# EasyEDA Pro project FireWheels.eprj, schematic Schematic1

## Sheets
1 P1: Board Name: RobotMotherboard; Create Date: 2025-05-01; Page Name: P1; Project Name: FireWheels; Schematic Name: Schematic1; Update Date: 2025-05-03; Company: EasyEDA.com; Page Size: A4; Version: V1.0
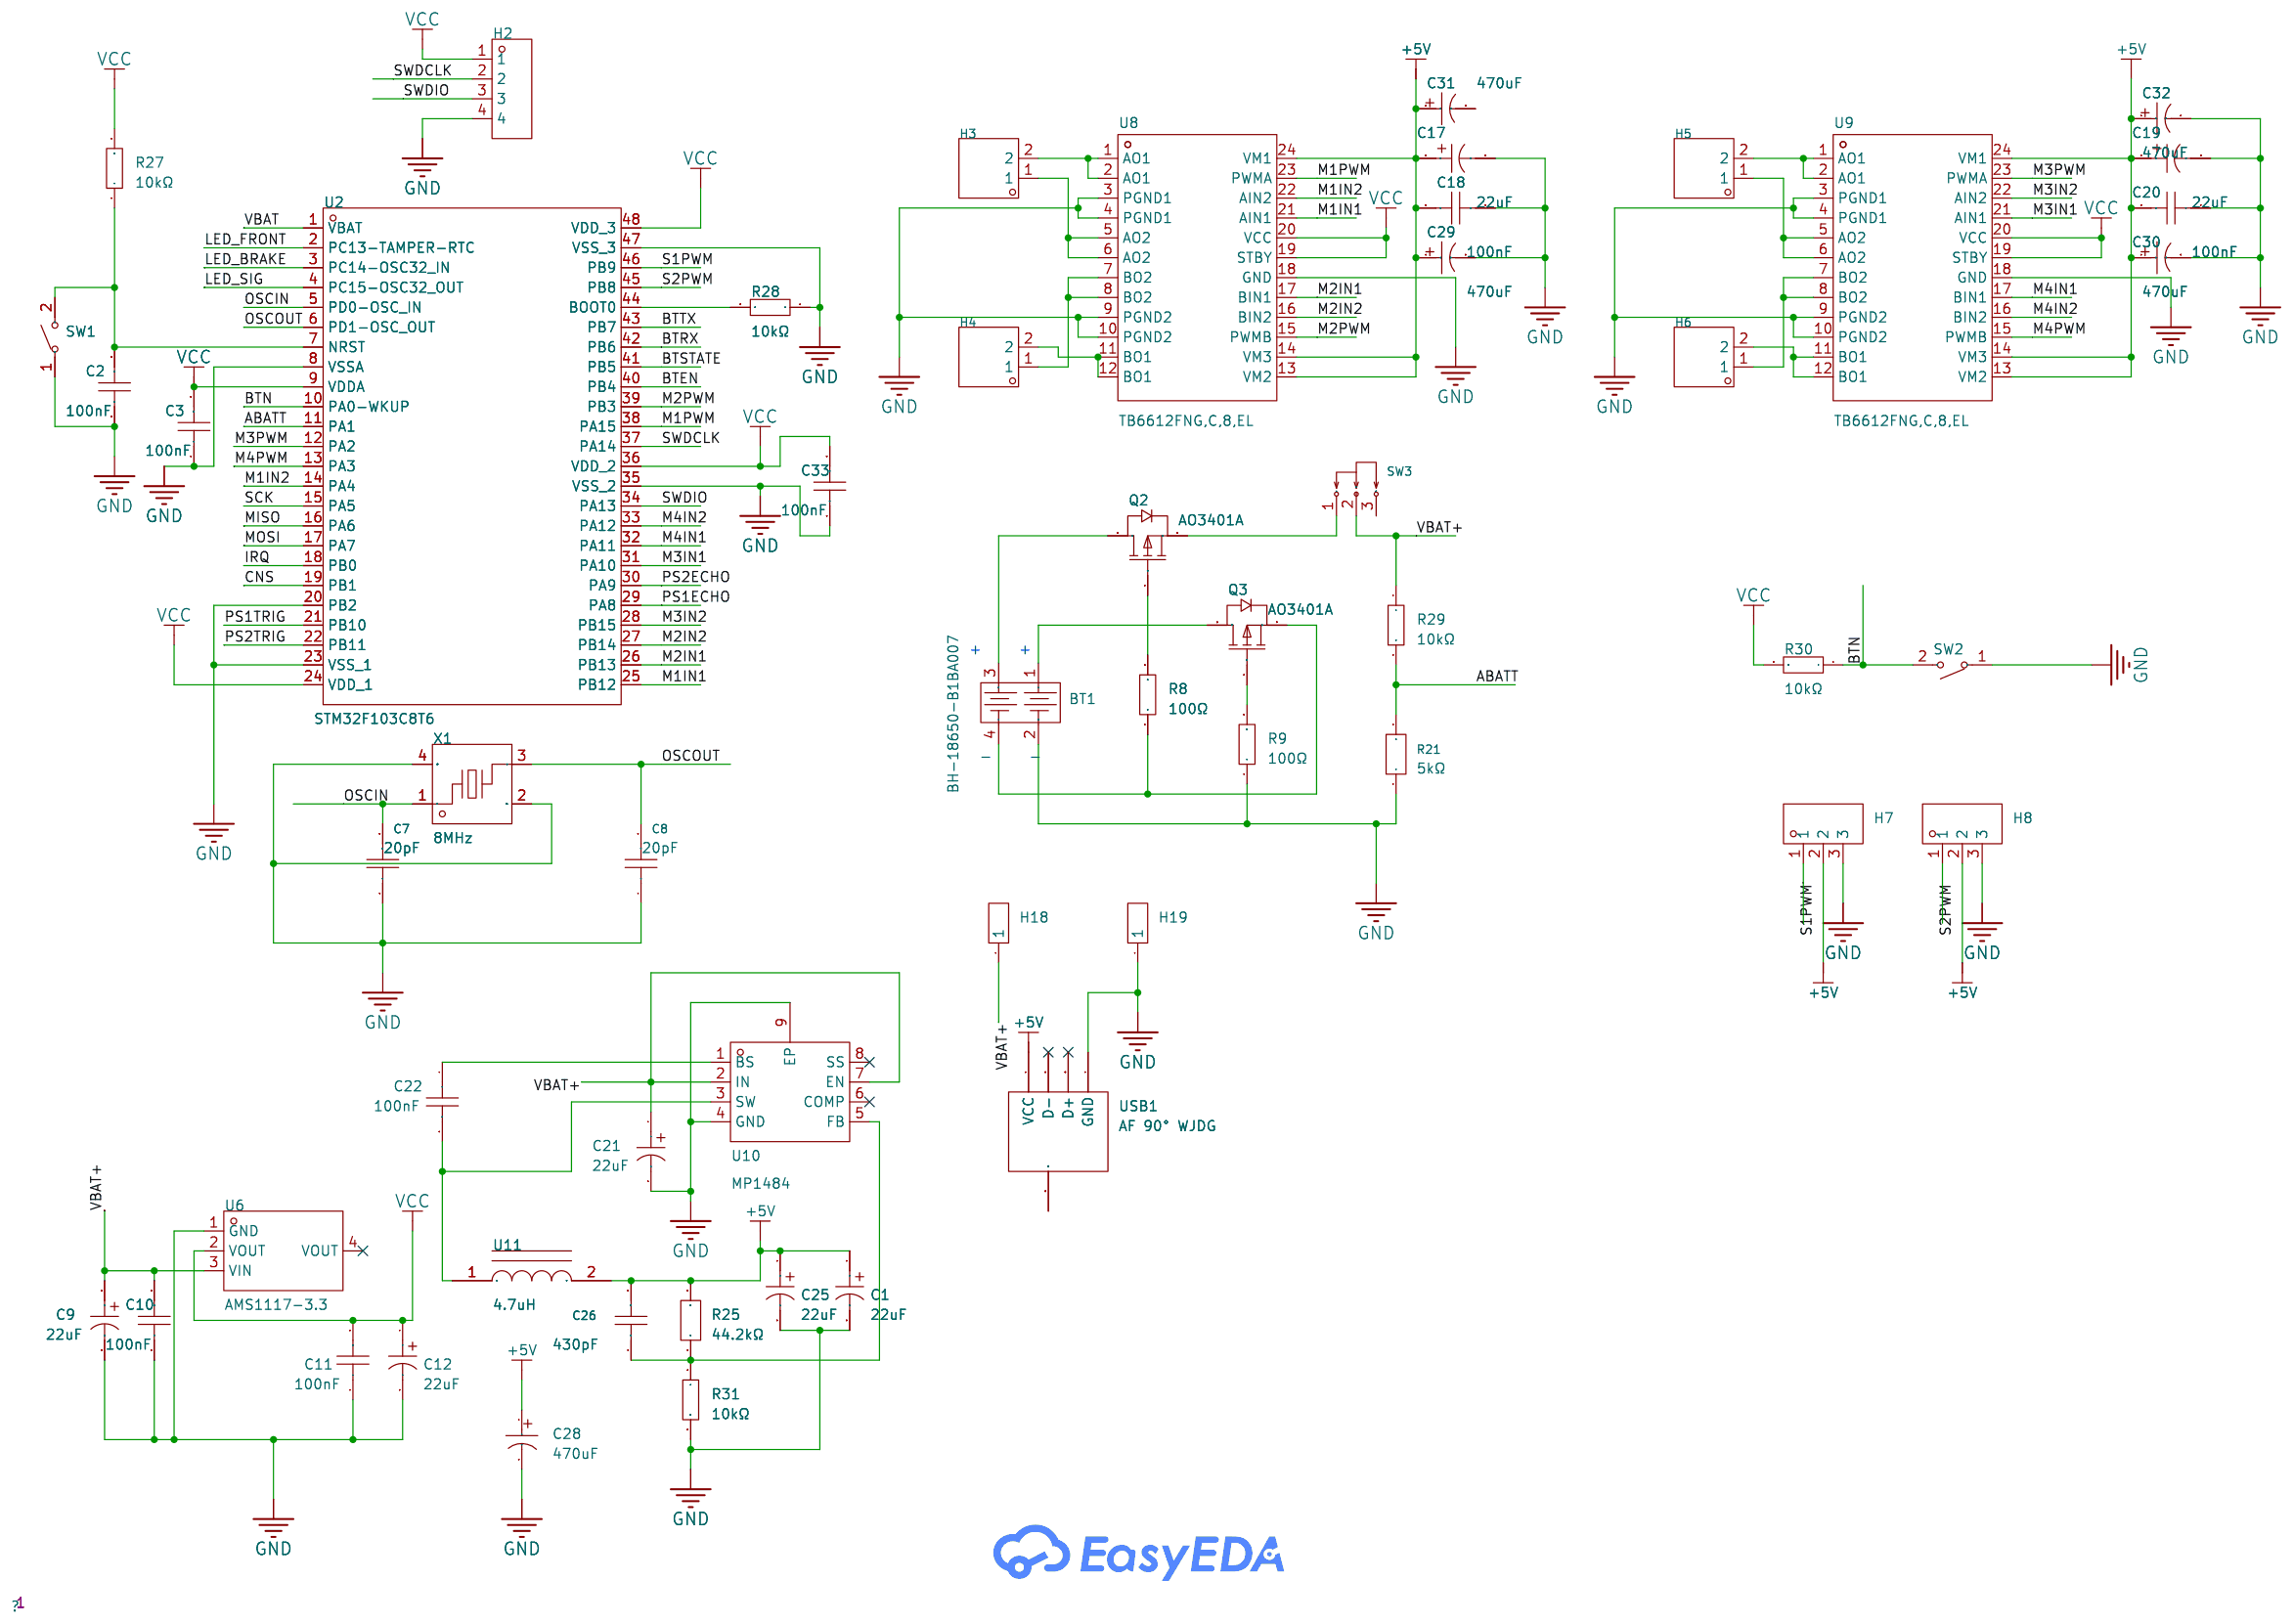
[diagram p0: P1]
2 P2: Create Date: 2025-05-02; Page Name: P2
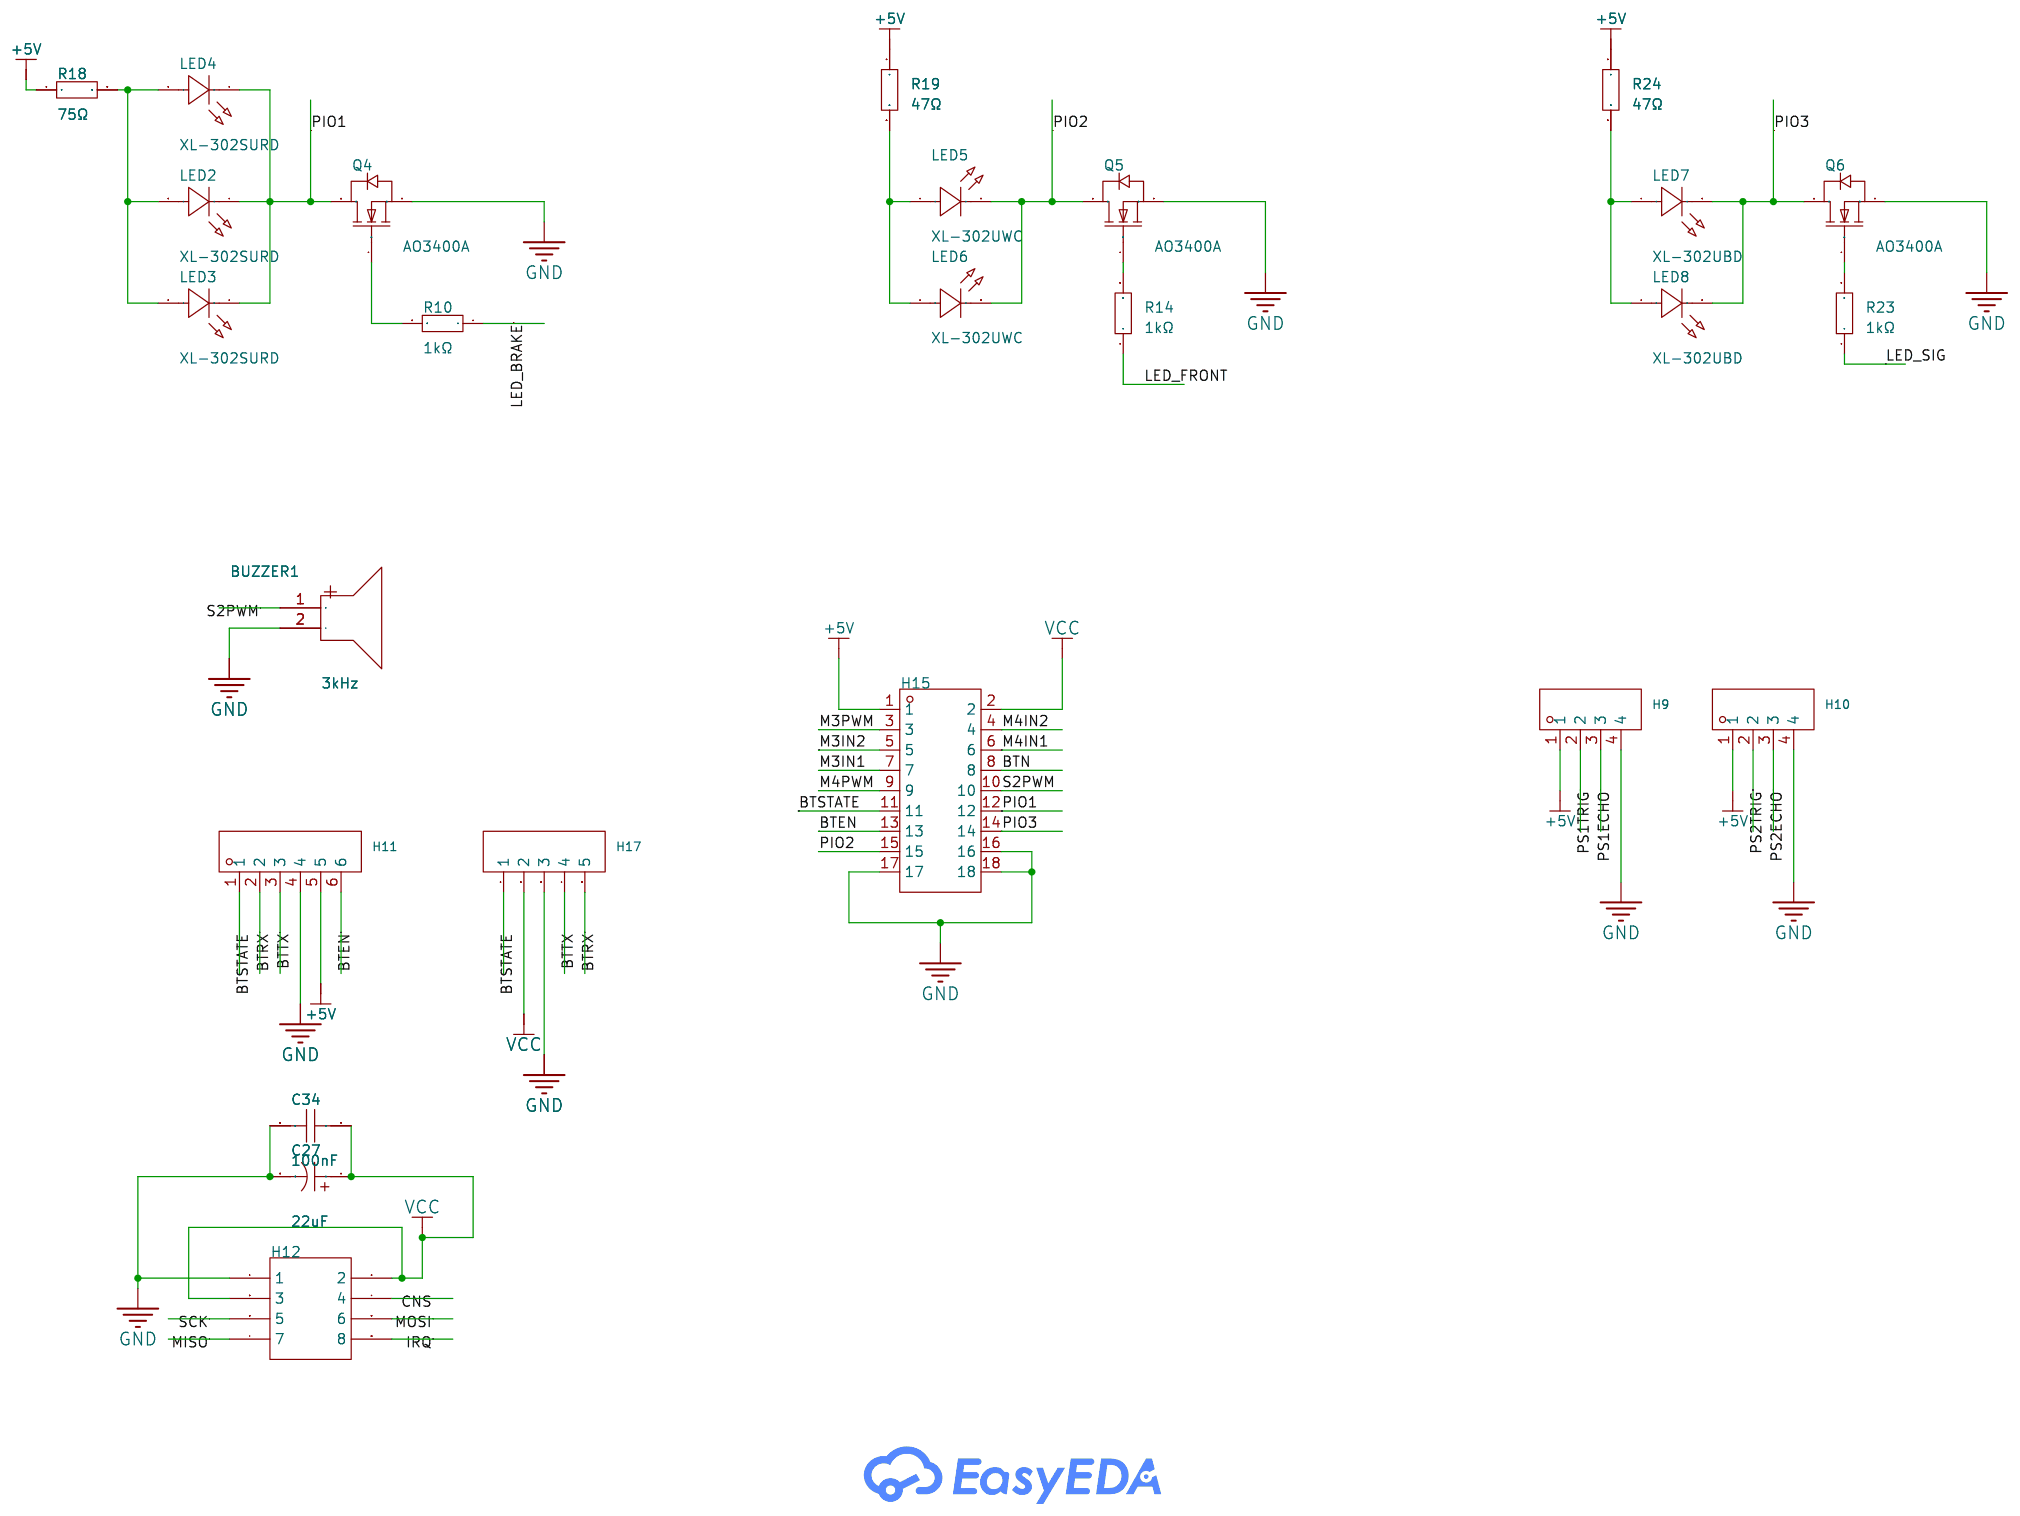
[diagram p1: P2]

## Parts
sheet P1
BT1  BH-18650-B1BA007  [BAT-SMD_BH-18650-B1BA007]
C1  22uF  [CAP-SMD_L3.5-W2.8-FD]
C2  100nF  [C0805]
C3  100nF  [C0805]
C7  20pF  [C0603]
C8  20pF  [C0603]
C9  22uF  [CAP-SMD_L3.5-W2.8-FD]
C10  100nF  [C0805]
C11  100nF  [C0805]
C12  22uF  [CAP-SMD_L3.5-W2.8-FD]
C17  22uF  [CAP-SMD_L3.5-W2.8-FD]
C18  100nF  [C0805]
C19  22uF  [CAP-SMD_L3.5-W2.8-FD]
C20  100nF  [C0805]
C21  22uF  [CAP-SMD_L3.5-W2.8-FD]
C22  100nF  [C0805]
C25  22uF  [CAP-SMD_L3.5-W2.8-FD]
C26  430pF  [C0603]
C28  470uF  [CAP-TH_BD8.0-P3.50-D0.6-FD]
C29  470uF  [CAP-TH_BD8.0-P3.50-D0.6-FD]
C30  470uF  [CAP-TH_BD8.0-P3.50-D0.6-FD]
C31  470uF  [CAP-TH_BD8.0-P3.50-D0.6-FD]
C32  470uF  [CAP-TH_BD8.0-P3.50-D0.6-FD]
C33  100nF  [C0805]
H2  -  [HDR-TH_4P-P2.54-V-M]
H3  -  [HDR-TH_2P-P2.54-V-M-1]
H4  -  [HDR-TH_2P-P2.54-V-M-1]
H5  -  [HDR-TH_2P-P2.54-V-M-1]
H6  -  [HDR-TH_2P-P2.54-V-M-1]
H7  -  [HDR-TH_3P-P2.54-V-M]
H8  -  [HDR-TH_3P-P2.54-V-M]
H18  -  [HDR-TH_1P-V-M_XKB_X4611WV-01I-C28D40]
H19  -  [HDR-TH_1P-V-M_XKB_X4611WV-01I-C28D40]
Q2  AO3401A  [SOT-23_L2.9-W1.3-P1.90-LS2.4-BR]
Q3  AO3401A  [SOT-23_L2.9-W1.3-P1.90-LS2.4-BR]
R8  100Ω  [R0603]
R9  100Ω  [R0603]
R21  5kΩ  [R0603]
R25  44.2kΩ  [R0603]
R27  10kΩ  [R0603]
R28  10kΩ  [R0603]
R29  10kΩ  [R0603]
R30  10kΩ  [R0603]
R31  10kΩ  [R0603]
SW1  -  [SW-SMD_L3.9-W3.0-P4.45]
SW2  -  [SW-SMD_L3.9-W3.0-P4.45]
SW3  SS12D10G4 071  [SW-TH_SHOU-HAN_SS12D10G4]
U2  STM32F103C8T6  [LQFP-48_L7.0-W7.0-P0.50-LS9.0-BL]
U6  AMS1117-3.3  [SOT-223-3_L6.7-W3.7-P2.30-LS7.0-BR]
U8  TB6612FNG,C,8,EL  [SSOP-24_L8.3-W5.6-P0.65-LS7.6-BL]
U9  TB6612FNG,C,8,EL  [SSOP-24_L8.3-W5.6-P0.65-LS7.6-BL]
U10  MP1484  [SOP-8_L4.9-W3.9-P1.27-LS6.0-BL-EP3.1]
U11  4.7uH  [IND-SMD_L4.4-W4.2]
USB1  AF 90° WJDG  [USB-A-TH_AF-WJDG]
X1  8MHz  [CRYSTAL-SMD_4P-L3.2-W2.5-BL]
sheet P2
BUZZER1  3kHz  [BUZ-TH_BD9.0-P5.00-D0.6-FD]
C27  22uF  [CAP-SMD_L3.5-W2.8-FD]
C34  100nF  [C0805]
H9  -  [HDR-TH_4P-P2.54-V-F]
H10  -  [HDR-TH_4P-P2.54-V-F]
H11  -  [HDR-TH_6P-P2.54-V-F]
H12  -  [HDR-TH_8P-P2.54-V-F-R2-C4-S2.54-1]
H15  -  [HDR-TH_18P-P2.54-V-M-R2-C9-S2.54]
H17  -  [HDR-TH_5P-P2.54-V-F]
LED2  XL-302SURD  [LED-TH_BD3.8-P2.54-RD]
LED3  XL-302SURD  [LED-TH_BD3.8-P2.54-RD]
LED4  XL-302SURD  [LED-TH_BD3.8-P2.54-RD]
LED5  XL-302UWC  [LED-TH_BD3.8-P2.54-FD_WHITE]
LED6  XL-302UWC  [LED-TH_BD3.8-P2.54-FD_WHITE]
LED7  XL-302UBD  [LED-TH_BD3.8-P2.54-FD_BLUE]
LED8  XL-302UBD  [LED-TH_BD3.8-P2.54-FD_BLUE]
Q4  AO3400A  [SOT-23-3_L2.9-W1.3-P1.90-LS2.4-BR]
Q5  AO3400A  [SOT-23-3_L2.9-W1.3-P1.90-LS2.4-BR]
Q6  AO3400A  [SOT-23-3_L2.9-W1.3-P1.90-LS2.4-BR]
R10  1kΩ  [R0603]
R14  1kΩ  [R0603]
R18  75Ω  [R1206]
R19  47Ω  [R1206]
R23  1kΩ  [R0603]
R24  47Ω  [R1206]

## Library data of the parts
BT1 = BH-18650-B1BA007: Connector Type:Battery box Battery Type:- Contact Material:Phosphor Bronze Contact Plating:Gold Operating Temperature Range:-25℃~+85℃ Operating Temperature Range:-25℃~+85℃; LCSC Part Name: 电池盒; Supplier Part: C6937126; Manufacturer: MYOUNG(美阳); Supplier Footprint: SMD; JLCPCB Part Class: Extended Part; Datasheet: https://atta.szlcsc.com/upload/public/pdf/source/20230625/4623181BB33816751543B6366072761C.pdf; Supplier: LCSC; Connector Type: Battery box; Contact Material: Phosphor Bronze; Contact Plating: Gold; Operating Temperature Range: -25℃~+85℃
C1 C9 C12 C17 C19 C21 C25 C27 = T491B226K004AT: Capacitance: Tolerance:±10% Tolerance:±10% Voltage Rating: Current - Leakage:- Ripple Current:- Equivalent Series Resistance(ESR):3.5Ω Operating Temperature:-55℃~+125℃ Operating Temperature:-55℃~+125℃; LCSC Part Name: 22uF ±10% 4V; Supplier Part: C1953267; Manufacturer: KEMET(基美); Supplier Footprint: 1411; JLCPCB Part Class: Extended Part; Datasheet: https://atta.szlcsc.com/upload/public/pdf/source/20210416/95C0EC5B3581C9A90529545117ABEAC1.pdf; Supplier: LCSC; Tolerance: ±10%; Equivalent Series Resistance(ESR): 3.5Ω; Operating Temperature: -55℃~+125℃
C2 C3 C10 C11 C18 C20 C22 C33 C34 = 0805B104K250NT: Capacitance:100nF Tolerance:±10% Tolerance:±10% Voltage Rating: Temperature Coefficient:; LCSC Part Name: 100nF ±10% 25V; Supplier Part: C5120075; Manufacturer: FH(风华); Supplier Footprint: 0805; JLCPCB Part Class: Extended Part; Datasheet: https://atta.szlcsc.com/upload/public/pdf/source/20220722/AC92D000C7DDA6224FF67F7486E69D7A.pdf; Supplier: LCSC; Tolerance: ±10%
C7 C8 = TCC0603COG200J500CT: Capacitance: Tolerance:±5% Tolerance:±5% Voltage Rated: Temperature Coefficient:; LCSC Part Name: 20pF ±5% 50V; Supplier Part: C376774; Manufacturer: CCTC(三环); Supplier Footprint: 0603; JLCPCB Part Class: Extended Part; Datasheet: https://atta.szlcsc.com/upload/public/pdf/source/20191203/C466239_F62A586702D44EEA1C39B32FC8662B21.pdf; Supplier: LCSC; Tolerance: ±5%
C26 = CC0603JRNPO9BN431: Capacitance: Tolerance:±5% Tolerance:±5% Voltage Rated: Temperature Coefficient:; LCSC Part Name: 430pF ±5% 50V; Supplier Part: C309472; Manufacturer: YAGEO(国巨); Supplier Footprint: 0603; JLCPCB Part Class: Extended Part; Datasheet: https://atta.szlcsc.com/upload/public/pdf/source/20191125/C354976_4A9AE911FA5758D8C0A36AE6394FD4D7.pdf; Supplier: LCSC; Tolerance: ±5%
C28-C32 = KM477M025F12RR0VH2FP0: Capacitance:470uF Tolerance:±20% Tolerance:±20% Voltage Rating:25V Pin Spacing:3.5mm Diameter:8mm Height - Seated (Max):12mm Lifetime:2000hrs@105℃; LCSC Part Name: 470uF ±20% 25V; Supplier Part: C43839; Manufacturer: CX(承兴); Supplier Footprint: 插件,D8xL12mm; JLCPCB Part Class: Extended Part; Datasheet: https://atta.szlcsc.com/upload/public/pdf/source/20230915/80F12A3CAB98DAEEC2984174CA9E6511.pdf; Supplier: LCSC; Tolerance: ±20%; Voltage Rating: 25V; Pin Spacing: 3.5mm; Diameter: 8mm; Height - Seated (Max): 12mm; Lifetime: 2000hrs@105℃
H2 = HDR-M_2.54_1x4P: Supplier Footprint: Through
H3-H6 = HDR-M_2.54_1x2P: Supplier Footprint: Through
H7 H8 = HDR-M_2.54_1x3P: Supplier Footprint: Through
H18 H19 = HDR-M_2.54_1x1P: Supplier Footprint: Through
Q2 Q3 = AO3401A_C15127: Type:1 Piece P-Channel Drain Source Voltage (Vdss): Continuous Drain Current (Id): Drain Source On Resistance (RDS(on)@Vgs,Id):44mΩ@10V,4.3A Power Dissipation (Pd): Gate Threshold Voltage (Vgs(th)@Id):1.3V@250uA Total Gate Charge (Qg@Vgs):12.2nC@4.5V Inpu; LCSC Part Name: 1个P沟道 耐压:30V 电流:4A; Supplier Part: C15127; Manufacturer: AOS; Supplier Footprint: SOT-23; JLCPCB Part Class: Basic Part; Datasheet: https://atta.szlcsc.com/upload/public/pdf/source/20160507/1462613609053.pdf; Supplier: LCSC; Type: 1 Piece P-Channel; Drain Source On Resistance (RDS(on)@Vgs,Id): 44mΩ@10V,4.3A; Gate Threshold Voltage (Vgs(th)@Id): 1.3V@250uA; Total Gate Charge (Qg@Vgs): 12.2nC@4.5V; Input Capacitance (Ciss@Vds): 1.2nF@15V; Operating Temperature: -55℃~+150℃@(Tj)
R8 R9 = 0603WAF1000T5E: Type:Thick Film Resistors Resistance: Tolerance:±1% Tolerance:±1% Power(Watts): Overload Voltage (Max): Temperature Coefficient:±200ppm/℃ Temperature Coefficient:±200ppm/℃ Operating Temperature Range:-55℃~+155℃ Operating Temperature Range:-55℃~+155℃; LCSC Part Name: 100Ω ±1% 100mW 厚膜电阻; Supplier Part: C22775; Manufacturer: UNI-ROYAL(厚声); Supplier Footprint: 0603; JLCPCB Part Class: Basic Part; Datasheet: https://atta.szlcsc.com/upload/public/pdf/source/20200306/C422600_1E6D84923E4A46A82E41ADD87F860B5C.pdf; Supplier: LCSC; Type: Thick Film Resistors; Tolerance: ±1%; Temperature Coefficient: ±200ppm/℃; Operating Temperature Range: -55℃~+155℃
R21 = RTT035001FTP: Type:Thick Film Resistors Resistance: Tolerance:±1% Tolerance:±1% Power(Watts): Overload Voltage (Max): Temperature Coefficient:±100ppm/℃ Temperature Coefficient:±100ppm/℃ Operating Temperature Range:-55℃~+155℃ Operating Temperature Range:-55℃~+155℃; LCSC Part Name: 厚膜电阻 5kΩ ±1% 100mW; Supplier Part: C166926; Manufacturer: RALEC(旺诠); Supplier Footprint: 0603; JLCPCB Part Class: Extended Part; Datasheet: https://atta.szlcsc.com/upload/public/pdf/source/20180928/C303758_52AE496EA05AD4D633595C32F5A0EBAF.pdf; Supplier: LCSC; Type: Thick Film Resistors; Tolerance: ±1%; Temperature Coefficient: ±100ppm/℃; Operating Temperature Range: -55℃~+155℃
R25 = FRC0603F4422TS: Type:Thick Film Resistors Resistance:44.2kΩ Tolerance:±1% Tolerance:±1% Power(Watts):0.1W Voltage-Supply(Max):75V Temperature Coefficient:±100ppm/℃ Temperature Coefficient:±100ppm/℃ Operating Temperature:-55℃~+155℃ Operating Temperature:-55℃~+155℃; LCSC Part Name: 44.2kΩ ±1% 100mW 厚膜电阻; Supplier Part: C2930103; Manufacturer: FOJAN(富捷); Supplier Footprint: 0603; JLCPCB Part Class: Extended Part; Datasheet: https://atta.szlcsc.com/upload/public/pdf/source/20211221/925EC7D7225764EE0046F22065062C87.pdf; Supplier: LCSC; Type: Thick Film Resistors; Tolerance: ±1%; Power(Watts): 0.1W; Voltage-Supply(Max): 75V; Temperature Coefficient: ±100ppm/℃; Operating Temperature: -55℃~+155℃
R27-R31 = RC0603FR-0710KL: Type:Thick Film Resistors Resistance: Tolerance:±1% Tolerance:±1% Power(Watts): Overload Voltage (Max): Temperature Coefficient:±100ppm/℃ Temperature Coefficient:±100ppm/℃ Operating Temperature Range:-55℃~+155℃ Operating Temperature Range:-55℃~+155℃; LCSC Part Name: 厚膜电阻 10kΩ ±1% 100mW; Supplier Part: C98220; Manufacturer: YAGEO(国巨); Supplier Footprint: 0603; JLCPCB Part Class: Extended Part; Datasheet: https://atta.szlcsc.com/upload/public/pdf/source/20180927/C295883_E8D83085EA81BD7DE0B2B681138C15EE.pdf; Supplier: LCSC; Type: Thick Film Resistors; Tolerance: ±1%; Temperature Coefficient: ±100ppm/℃; Operating Temperature Range: -55℃~+155℃
SW1 SW2 = TS-1088R-02026: Contact Current:50mA Voltage Rating (DC):12V Circuit:SPST Mounting Style:Brick nogging Actuator Style:Round Button With Lamp:- Switch Length:3.9mm Switch Width:2.93mm Switch Height:2mm; LCSC Part Name: 贴片无柱小龟轻触开关 260GF; Supplier Part: C455280; Manufacturer: XUNPU(讯普); Supplier Footprint: SMD,3x4x2mm; JLCPCB Part Class: Extended Part; Datasheet: https://atta.szlcsc.com/upload/public/pdf/source/20191118/C455280_718CC4284DAF75EEB0AC8229AE7E40C5.pdf; Supplier: LCSC; Contact Current: 50mA; Voltage Rating (DC): 12V; Circuit: SPST; Mounting Style: Brick nogging; Actuator Style: Round Button; Switch Length: 3.9mm; Switch Width: 2.93mm; Switch Height: 2mm
SW3 = SS12D10G4 071: Circuit:SPDT Actuator Style:- Pin Style:PCPin Switch Length:12.7mm Switch Width:6.7mm Switch Height:6.4mm Mounting Style:Straight Actuator Color:- Current Rating (DC):2A Voltage Rating (DC):125V Current Rating (AC):- Voltage Rating (AC):- Mechanical Life:; Supplier Part: C2887259; Manufacturer: SHOU HAN(首韩); Supplier Footprint: 插件; JLCPCB Part Class: Extended Part; Datasheet: https://atta.szlcsc.com/upload/public/pdf/source/20210820/80D1704BBF3FCEE0435FCAA54C61E0A3.pdf; Supplier: LCSC; Circuit: SPDT; Pin Style: PCPin; Switch Length: 12.7mm; Switch Width: 6.7mm; Switch Height: 6.4mm; Mounting Style: Straight; Current Rating (DC): 2A; Voltage Rating (DC): 125V; Mechanical Life: 3千次; Operating Temperature: -16℃~+60℃
U2 = STM32F103C8T6: CPU Core:ARM-M3 CPU Maximum Speed:72MHz Program Storage Size:64KB Program Memory Type:FLASH Number of I/O:37 ADC (Bit):12bit Low Voltage Detection Threshold:2V~3.6V Low Voltage Detection Threshold:2V~3.6V Application Area:-; LCSC Part Name: 主流增强型ARM Cortex-M3 MCU，具有64 KB Flash、72 MHz CPU、电机控制、USB和CAN; Supplier Part: C8734; Manufacturer: ST(意法半导体); Supplier Footprint: LQFP-48(7x7); JLCPCB Part Class: Extended Part; Datasheet: https://atta.szlcsc.com/upload/public/pdf/source/20220812/8363ACEC51AD55ECEB84799464F7CB85.pdf; Supplier: LCSC; CPU Core: ARM-M3; CPU Maximum Speed: 72MHz; Program Storage Size: 64KB; Program Memory Type: FLASH; Number of I/O: 37; ADC (Bit): 12bit; Low Voltage Detection Threshold: 2V~3.6V
U6 = AMS1117-3.3_C917183: Output Type:Fixed Maximum Input Voltage:- Output Voltage:3.3V Output Voltage:3.3V Output Current:1A Power Supply Rejection Ratio (PSRR):72dB@120Hz Dropout Voltage:1.3V@(1A) standby current:- Noise:- Feature:Thermal Protection(TSD) Operating Temperature:-; LCSC Part Name: 正 Vin=15V Vout=3.3V 1A; Supplier Part: C917183; Manufacturer: JSMSEMI(杰盛微); Supplier Footprint: SOT-223-3; JLCPCB Part Class: Extended Part; Datasheet: https://atta.szlcsc.com/upload/public/pdf/source/20241031/020B33F96DEC818342B616F1580B891C.pdf; Supplier: LCSC; Output Type: Fixed; Output Voltage: 3.3V; Output Current: 1A; Power Supply Rejection Ratio (PSRR): 72dB@120Hz; Dropout Voltage: 1.3V@(1A); Feature: Thermal Protection(TSD)
U8 U9 = TB6612FNG,C,8,EL: LCSC Part Name: 1A 有刷直流电机驱动芯片 5.5V; Supplier Part: C141517; Manufacturer: TOSHIBA(东芝); Supplier Footprint: SSOP-24; JLCPCB Part Class: Extended Part; Datasheet: https://atta.szlcsc.com/upload/public/pdf/source/20171128/C141517_15118625624231147036.pdf; Supplier: LCSC
U10 = MP1484: Function:Step-down type Output Type:Adjustable Input Voltage:4.5V~18V Input Voltage:4.5V~18V Output Voltage:- Output Voltage:- Output Current:3A Switching Frequency:500kHz Switching Frequency:500kHz Operating Temperature:-40℃~+85℃ Operating Temperature:-4; LCSC Part Name: 18V 3A 500KHz 同步降压调节器; Supplier Part: C917144; Manufacturer: JSMSEMI(杰盛微); Supplier Footprint: ESOP-8; JLCPCB Part Class: Extended Part; Datasheet: https://atta.szlcsc.com/upload/public/pdf/source/20240105/20BB28029D0E5A93788E1CD1A47CBD0B.pdf; Supplier: LCSC; Function: Step-down type; Output Type: Adjustable; Input Voltage: 4.5V~18V; Output Current: 3A; Switching Frequency: 500kHz; Operating Temperature: -40℃~+85℃; Number of Outputs: 1; Topology: Step-down; Quiescent Current (Iq): 800uA; Switch tube (built-in/external): Built-in
U11 = BCIHP0420SC-4R7M: Inductance: Tolerance:±20% Tolerance:±20% Rated Current: Saturation Current (Isat): DC Resistance (DCR):126mΩ Q @ Freq:- Frequency - Self Resonant:-; LCSC Part Name: 4.7uH ±20% 3A; Supplier Part: C2921168; Manufacturer: BC(台湾诚阳); Supplier Footprint: SMD,4.2x4.4mm; JLCPCB Part Class: Extended Part; Datasheet: https://atta.szlcsc.com/upload/public/pdf/source/20220607/0F62A2B68923DD0945D5F83B99590D06.pdf; Supplier: LCSC; Tolerance: ±20%; DC Resistance (DCR): 126mΩ
USB1 = AF 90° WJDG: Connector Type:Type-A Standard:USB 2.0 Gender:Mother Mounting Style:Bend-in Number of Contacts:4P Number of Ports:1 Current Rating - Power (Max):1.5A Rated Voltage (Max):30V Connect-Disconnect Life:5000 Cuts Supplementary Features:- Center Height:- Length; LCSC Part Name: Type-A 母 弯插; Supplier Part: C456018; Manufacturer: SHOU HAN(首韩); Supplier Footprint: 插件; JLCPCB Part Class: Extended Part; Datasheet: https://atta.szlcsc.com/upload/public/pdf/source/20241125/1CC41152EE29FFE03A5868591A920D3B.pdf; Supplier: LCSC; Connector Type: Type-A; Standard: USB 2.0; Gender: Mother; Mounting Style: Bend-in; Number of Contacts: 4P; Number of Ports: 1; Current Rating - Power (Max): 1.5A; Rated Voltage (Max): 30V; Connect-Disconnect Life: 5000 Cuts; Length: 14mm; Core Colour: White; Operating Temperature Range: -25℃~+85℃
X1 = 3TJ480000NWLAC: Type:Surface Mount Crystal Frequency:8MHz Normal temperature Frequency Tolerance:±20ppm Normal temperature Frequency Tolerance:±20ppm Load Capacitance:; LCSC Part Name: 8MHz ±20ppm 12pF; Supplier Part: C3031829; Manufacturer: JYJE(晶友嘉); Supplier Footprint: SMD3225-4P; JLCPCB Part Class: Extended Part; Datasheet: https://atta.szlcsc.com/upload/public/pdf/source/20210114/C2149013_C841380407E0329693B4ECED06382C6A.pdf; Supplier: LCSC; Type: Surface Mount Crystal; Normal temperature Frequency Tolerance: ±20ppm
BUZZER1 = HNB09A03: Driver Circuitry:Active (Built-in Driver Circuit) Technology:Electromagnetic Type Voltage - Supply:1.5V~4.5V Voltage - Supply:1.5V~4.5V Frequency:3kHz Current Consumption:30mA Sound Pressure Level(SPL):85dB Diameter(φD):9mm Length:- Width:- Height:5.5mm O; LCSC Part Name: 电磁式有源一体蜂鸣器HNB09A03; Supplier Part: C96102; Manufacturer: 华能; Supplier Footprint: 插件,D=9mm; JLCPCB Part Class: Extended Part; Datasheet: https://atta.szlcsc.com/upload/public/pdf/source/20241128/61C4C8C3938BB25F7C38FBE94CCE8DCF.pdf; Supplier: LCSC; Driver Circuitry: Active (Built-in Driver Circuit); Technology: Electromagnetic Type; Voltage - Supply: 1.5V~4.5V; Current Consumption: 30mA; Sound Pressure Level(SPL): 85dB; Diameter(φD): 9mm; Height: 5.5mm; Operating Temperature: -20℃~+70℃
H9 H10 = HDR-F_2.54_1x4P: Supplier Footprint: Through
H11 = HDR-F_2.54_1x6P: Supplier Footprint: Through
H12 = HDR-F-2.54_2x4: Supplier Footprint: Through
H15 = HDR-M_2.54_2x9: Supplier Footprint: Through
H17 = HDR-F_2.54_1x5P: Supplier Footprint: Through
LED2-LED4 = XL-302SURD: Lamp Holder Type:3mm圆形灯头 Emitted Color:Red Power Dissipation:80mW Forward Current:30mA Dominant Wavelength:615nm~620nm Dominant Wavelength:615nm~620nm Peak Wavelength:625nm Lens Color:红色透镜 Color Temperature:- Color Temperature:- Viewing Angle:50° Mounting; Supplier Part: C2895470; Manufacturer: XINGLIGHT(成兴光); Supplier Footprint: 插件,D=3mm; JLCPCB Part Class: Extended Part; Datasheet: https://atta.szlcsc.com/upload/public/pdf/source/20240112/E1E2B82945FD635E4907401DDE6D4922.pdf; Supplier: LCSC; Lamp Holder Type: 3mm圆形灯头; Emitted Color: Red; Power Dissipation: 80mW; Forward Current: 30mA; Dominant Wavelength: 615nm~620nm; Peak Wavelength: 625nm; Lens Color: 红色透镜; Viewing Angle: 50°; Operating Temperature: -25℃~+85℃
LED5 LED6 = XL-302UWC: Lamp Holder Type:3mm round bulb Illumination Color:White Voltage - Forward(Vf):3.2V Voltage - Forward(Vf):3.2V Power(Watts):70mW Forward Current:20mA Lens Color:Colorless Transparent Lens Color Temperature:6000K~8000K Color Temperature:6000K~8000K Luminou; Supplier Part: C2895458; Manufacturer: XINGLIGHT(成兴光); Supplier Footprint: 插件,D=3mm; JLCPCB Part Class: Extended Part; Datasheet: https://atta.szlcsc.com/upload/public/pdf/source/20240112/543BCCAC3CB93518E6AD22EB07A95060.pdf; Supplier: LCSC; Lamp Holder Type: 3mm round bulb; Illumination Color: White; Voltage - Forward(Vf): 3.2V; Power(Watts): 70mW; Forward Current: 20mA; Lens Color: Colorless Transparent Lens; Color Temperature: 6000K~8000K; Luminous Intensity: 8000mcd; Viewing Angle: 30°; Operating Temperature: -20℃~+85℃
LED7 LED8 = XL-302UBD: Lamp Holder Type:3mm round bulb Emitted Color:Blue Forward Voltage (VF):3.4V Forward Voltage (VF):3.4V Power Dissipation:70mW Forward Current:20mA Dominant Wavelength:460nm~465nm Dominant Wavelength:460nm~465nm Peak Wavelength:460nm Lens Color:Blue Lens C; Supplier Part: C2895474; Manufacturer: XINGLIGHT(成兴光); Supplier Footprint: 插件,D=3mm; JLCPCB Part Class: Extended Part; Datasheet: https://atta.szlcsc.com/upload/public/pdf/source/20240112/D32096FD17ADF843BFE6A9D946368B54.pdf; Supplier: LCSC; Lamp Holder Type: 3mm round bulb; Emitted Color: Blue; Forward Voltage (VF): 3.4V; Power Dissipation: 70mW; Forward Current: 20mA; Dominant Wavelength: 460nm~465nm; Peak Wavelength: 460nm; Lens Color: Blue Lens; Luminous Intensity: 1500mcd; Viewing Angle: 50°; Operating Temperature: -20℃~+85℃
Q4-Q6 = AO3400A_C20917: Type:1 N-Channel Drain Source Voltage (Vdss): Continuous Drain Current (Id): Drain Source On Resistance (RDS(on)@Vgs,Id):26.5mΩ@10V,5.7A Power Dissipation (Pd): Gate Threshold Voltage (Vgs(th)@Id):1.5V@250uA Total Gate Charge (Qg@Vgs):7nC@4.5V Input Capac; LCSC Part Name: 1个N沟道 耐压:30V 电流:5.7A; Supplier Part: C20917; Manufacturer: AOS; Supplier Footprint: SOT-23-3L; JLCPCB Part Class: Basic Part; Datasheet: https://atta.szlcsc.com/upload/public/pdf/source/20140107/1457706668533.pdf; Supplier: LCSC; Type: 1 N-Channel; Drain Source On Resistance (RDS(on)@Vgs,Id): 26.5mΩ@10V,5.7A; Gate Threshold Voltage (Vgs(th)@Id): 1.5V@250uA; Total Gate Charge (Qg@Vgs): 7nC@4.5V; Input Capacitance (Ciss@Vds): 630pF@15V; Operating Temperature: -55℃~+150℃@(Tj)
R10 R14 R23 = RC0603FR-071KL: Type:Thick Film Resistors Resistance: Tolerance:±1% Tolerance:±1% Power(Watts): Overload Voltage (Max): Temperature Coefficient:±100ppm/℃ Temperature Coefficient:±100ppm/℃ Operating Temperature Range:-55℃~+155℃ Operating Temperature Range:-55℃~+155℃; LCSC Part Name: 厚膜电阻 1kΩ ±1% 100mW; Supplier Part: C22548; Manufacturer: YAGEO(国巨); Supplier Footprint: 0603; JLCPCB Part Class: Extended Part; Datasheet: https://atta.szlcsc.com/upload/public/pdf/source/20180316/70C0E2BDAE7FCC62C531A5A58D202EE1.pdf; Supplier: LCSC; Type: Thick Film Resistors; Tolerance: ±1%; Temperature Coefficient: ±100ppm/℃; Operating Temperature Range: -55℃~+155℃
R18 = RC1206FR-0775RL: Type:Thick Film Resistors Resistance: Tolerance:±1% Tolerance:±1% Power(Watts):250mW Overload Voltage (Max): Temperature Coefficient:±100ppm/℃ Temperature Coefficient:±100ppm/℃ Operating Temperature Range:-55℃~+155℃ Operating Temperature Range:-55℃~+155℃; LCSC Part Name: 厚膜电阻 75Ω ±1% 250mW; Supplier Part: C137233; Manufacturer: YAGEO(国巨); Supplier Footprint: 1206; JLCPCB Part Class: Extended Part; Datasheet: https://atta.szlcsc.com/upload/public/pdf/source/20180224/C181757_15194369480721363983.pdf; Supplier: LCSC; Type: Thick Film Resistors; Tolerance: ±1%; Power(Watts): 250mW; Temperature Coefficient: ±100ppm/℃; Operating Temperature Range: -55℃~+155℃
R19 R24 = RC1206FR-0747RL: Type:Thick Film Resistors Resistance: Tolerance:±1% Tolerance:±1% Power(Watts):250mW Overload Voltage (Max): Temperature Coefficient:±100ppm/℃ Temperature Coefficient:±100ppm/℃ Operating Temperature Range:-55℃~+155℃ Operating Temperature Range:-55℃~+155℃; LCSC Part Name: 厚膜电阻 47Ω ±1% 250mW; Supplier Part: C137268; Manufacturer: YAGEO(国巨); Supplier Footprint: 1206; JLCPCB Part Class: Extended Part; Datasheet: https://atta.szlcsc.com/upload/public/pdf/source/20180224/C181757_15194369480721363983.pdf; Supplier: LCSC; Type: Thick Film Resistors; Tolerance: ±1%; Power(Watts): 250mW; Temperature Coefficient: ±100ppm/℃; Operating Temperature Range: -55℃~+155℃

## Nets
+5V: C1.1 C17.1 C18.2 C19.1 C20.2 C25.1 C26.2 C28.1 C29.1 C30.1 C31.1 C32.1 H7.2 H8.2 H9.1 H10.1 H11.5 H15.1 R18.1 R19.1 R24.1 R25.2 U8.13(VM2) U8.14(VM3) U8.24(VM1) U9.13(VM2) U9.14(VM3) U9.24(VM1) U11.2 USB1.1(VCC)
GND: BT1.2 BUZZER1.2(-) C1.2 C2.1 C3.1 C7.1 C8.1 C9.2 C10.1 C11.1 C12.2 C17.2 C18.1 C19.2 C20.1 C21.2 C25.2 C27.2 C28.2 C29.2 C30.2 C32.2 C33.1 C34.2 H2.4 H7.3 H8.3 H9.4 H10.4 H11.4 H12.1 H15.16 H15.17 H15.18 H17.3 H19.1 Q4.2(S) Q5.2(S) Q6.2(S) R9.1 R21.1 R28.1 R31.2 SW1.1 SW2.1 U2.8(VSSA) U2.20(PB2) U2.23(VSS_1) U2.35(VSS_2) U2.47(VSS_3) U6.1(GND) U8.3(PGND1) U8.4(PGND1) U8.9(PGND2) U8.10(PGND2) U8.18(GND) U9.3(PGND1) U9.4(PGND1) U9.9(PGND2) U9.10(PGND2) U9.18(GND) U10.4(GND) U10.9(EP) USB1.4(GND) X1.2(GND) X1.4(GND)
VBAT: U2.1(VBAT)
VBAT+: C9.1 C10.2 C21.1 H18.1 R29.1 SW3.2 U6.3(VIN) U10.2(IN) U10.7(EN)
VCC: C3.2 C11.2 C12.1 C27.1 C33.2 C34.1 H2.1 H12.2 H12.3 H15.2 H17.2 R27.2 R30.2 U2.9(VDDA) U2.24(VDD_1) U2.36(VDD_2) U2.48(VDD_3) U6.2(VOUT) U8.19(STBY) U8.20(VCC) U9.19(STBY) U9.20(VCC)
ABATT: R21.2 R29.2 U2.11(PA1)
BTEN: H11.6 H15.13 U2.40(PB4)
BTN: H15.8 R30.1 SW2.2 U2.10(PA0-WKUP)
BTRX: H11.2 H17.5 U2.42(PB6)
BTSTATE: H11.1 H15.11 H17.1 U2.41(PB5)
BTTX: H11.3 H17.4 U2.43(PB7)
CNS: H12.4 U2.19(PB1)
IRQ: H12.8 U2.18(PB0)
LED_BRAKE: R10.1 U2.3(PC14-OSC32_IN)
LED_FRONT: R14.1 U2.2(PC13-TAMPER-RTC)
LED_SIG: R23.1 U2.4(PC15-OSC32_OUT)
M1IN1: U2.25(PB12) U8.21(AIN1)
M1IN2: U2.14(PA4) U8.22(AIN2)
M1PWM: U2.38(PA15) U8.23(PWMA)
M2IN1: U2.26(PB13) U8.17(BIN1)
M2IN2: U2.27(PB14) U8.16(BIN2)
M2PWM: U2.39(PB3) U8.15(PWMB)
M3IN1: H15.7 U2.31(PA10) U9.21(AIN1)
M3IN2: H15.5 U2.28(PB15) U9.22(AIN2)
M3PWM: H15.3 U2.12(PA2) U9.23(PWMA)
M4IN1: H15.6 U2.32(PA11) U9.17(BIN1)
M4IN2: H15.4 U2.33(PA12) U9.16(BIN2)
M4PWM: H15.9 U2.13(PA3) U9.15(PWMB)
MISO: H12.7 U2.16(PA6)
MOSI: H12.6 U2.17(PA7)
OSCIN: C7.2 U2.5(PD0-OSC_IN) X1.1
OSCOUT: C8.2 U2.6(PD1-OSC_OUT) X1.3
PIO1: H15.12 LED2.1(K) LED3.1(K) LED4.1(K) Q4.3(D)
PIO2: H15.15 LED5.2(K) LED6.2(K) Q5.3(D)
PIO3: H15.14 LED7.2(A) LED8.2(A) Q6.3(D)
PS1ECHO: H9.3 U2.29(PA8)
PS1TRIG: H9.2 U2.21(PB10)
PS2ECHO: H10.3 U2.30(PA9)
PS2TRIG: H10.2 U2.22(PB11)
S1PWM: H7.1 U2.46(PB9)
S2PWM: BUZZER1.1(+) H8.1 H15.10 U2.45(PB8)
SCK: H12.5 U2.15(PA5)
SWDCLK: H2.2 U2.37(PA14)
SWDIO: H2.3 U2.34(PA13)
$1N523: R28.2 U2.44(BOOT0)
$1N2497: Q2.1(G) R8.2
$1N3339: Q3.1(G) R9.2
$1N3721: H3.2 U8.1(AO1) U8.2(AO1)
$1N3888: H3.1 U8.5(AO2) U8.6(AO2)
$1N12792: C22.1 U10.1(BS)
$1N12807: C22.2 U10.3(SW) U11.1
$1N14747: C26.1 R25.1 R31.1 U10.5(FB)
$1N18729: H4.2 U8.11(BO1) U8.12(BO1)
$1N18746: H4.1 U8.7(BO2) U8.8(BO2)
$2N1074: Q6.1(G) R23.2
$2N1081: Q5.1(G) R14.2
$2N1094: Q4.1(G) R10.2
Net-(BT1-1): BT1.1 Q3.3(D)
Net-(BT1-3): BT1.3 Q2.3(D)
Net-(BT1-4): BT1.4 Q3.2(S) R8.1
Net-(C2-2): C2.2 R27.1 SW1.2 U2.7(NRST)
Net-(H5-1): H5.1 U9.5(AO2) U9.6(AO2)
Net-(H5-2): H5.2 U9.1(AO1) U9.2(AO1)
Net-(H6-1): H6.1 U9.7(BO2) U9.8(BO2)
Net-(H6-2): H6.2 U9.11(BO1) U9.12(BO1)
Net-(LED2-2): LED2.2(A) LED3.2(A) LED4.2(A) R18.2
Net-(LED5-1): LED5.1(A) LED6.1(A) R19.2
Net-(LED7-1): LED7.1(K) LED8.1(K) R24.2
Net-(Q2-2): Q2.2(S) SW3.1

Not connected (* = marked no-connect by the designer): C31 2; SW3 3; U6 4(VOUT)*; U10 6(COMP)* 8(SS)*; USB1 2(D-)* 3(D+)* 5(SHLD)

## Notes on the sheets
sheet 1
- +
- +
- -
- -
